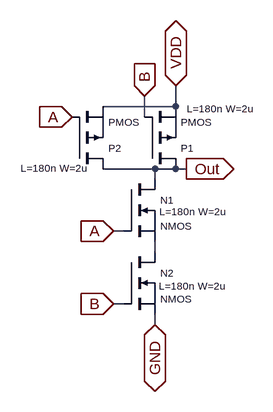
[diagram p0: schematic CMOS_NAND_2input.asc]
CMOS_NAND_2input.asc, the LTspice schematic file:
Version 4.1
SHEET 1 880 680
WIRE 144 -192 144 -224
WIRE 144 -192 32 -192
WIRE 96 -176 96 -208
WIRE 112 -96 32 -96
WIRE 144 -96 112 -96
WIRE 160 -96 144 -96
WIRE 112 -80 112 -96
WIRE 64 0 48 0
WIRE 112 32 112 16
WIRE 64 112 48 112
WIRE 112 144 112 128
FLAG -16 -176 A
IOPIN -16 -176 In
FLAG 96 -208 B
IOPIN 96 -208 In
FLAG 144 -224 VDD
IOPIN 144 -224 BiDir
FLAG 112 144 GND
IOPIN 112 144 BiDir
FLAG 48 0 A
IOPIN 48 0 In
FLAG 48 112 B
IOPIN 48 112 In
FLAG 160 -96 Out
IOPIN 160 -96 Out
SYMBOL pmos 96 -96 M180
WINDOW 0 56 32 Left 1
WINDOW 3 56 72 Left 1
WINDOW 123 65 93 Left 1
SYMATTR InstName P1
SYMATTR Value2 L=180n W=2u
SYMBOL pmos -16 -96 M180
WINDOW 0 56 32 Left 1
WINDOW 3 56 72 Left 1
WINDOW 123 -79 1 Left 1
SYMATTR InstName P2
SYMATTR Value2 L=180n W=2u
SYMBOL nmos 64 -80 R0
WINDOW 0 56 32 Left 1
WINDOW 3 56 72 Left 1
WINDOW 123 55 50 Left 1
SYMATTR InstName N1
SYMATTR Value2 L=180n W=2u
SYMBOL nmos 64 32 R0
WINDOW 0 56 32 Left 1
WINDOW 3 56 72 Left 1
WINDOW 123 54 52 Left 1
SYMATTR InstName N2
SYMATTR Value2 L=180n W=2u

The netlist it stands for:
* CMOS_NAND_2input.asc
M§P1 Out B VDD VDD PMOS L=180n W=2u
M§P2 Out A VDD VDD PMOS L=180n W=2u
M§N1 Out A N001 N001 NMOS L=180n W=2u
M§N2 N001 B GND GND NMOS L=180n W=2u
.model NMOS NMOS
.model PMOS PMOS
.lib standard.mos
.backanno
.end